# Altium schematic sheet tree_io.SchDoc
size A4
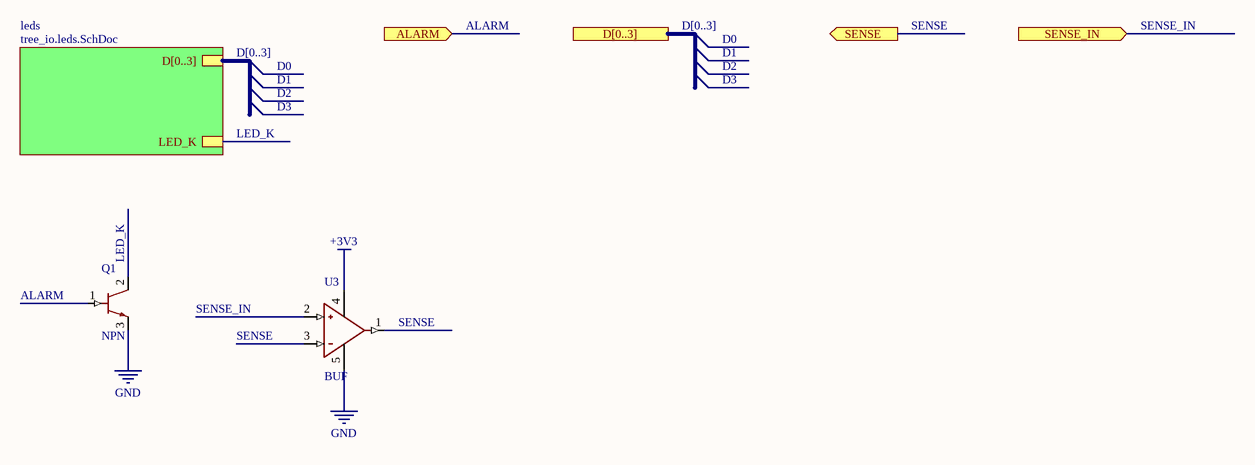
[diagram p0: tree_io.SchDoc]

## Parts
Q1  NPN  [SOT23]
U3  BUF  [SOT23-5]

## Sub-sheets
leds = tree_io.leds.SchDoc: D[0..3], LED_K

## Ports
ALARM (in), D[0..3], SENSE (out), SENSE_IN (in)

## Nets
+3V3: U3.4(V+)
GND: Q1.3(E) U3.5(V-)
ALARM: Q1.1(B) ; port ALARM
LED_K: Q1.2(C) ; sheet leds/LED_K
SENSE: U3.1 U3.3(-) ; port SENSE
SENSE_IN: U3.2(+) ; port SENSE_IN

## Buses and harness runs
bus D[0..3] = port D[0..3]
bus D[0..3] = sheet leds/D[0..3]

## Library data of the parts
Q1 = BJT_NPN
U3 = Operational_Amplifier